# EAGLE design Arduino_Nano_Clock_Divider_pcb2 (EAGLE 9.1.1)
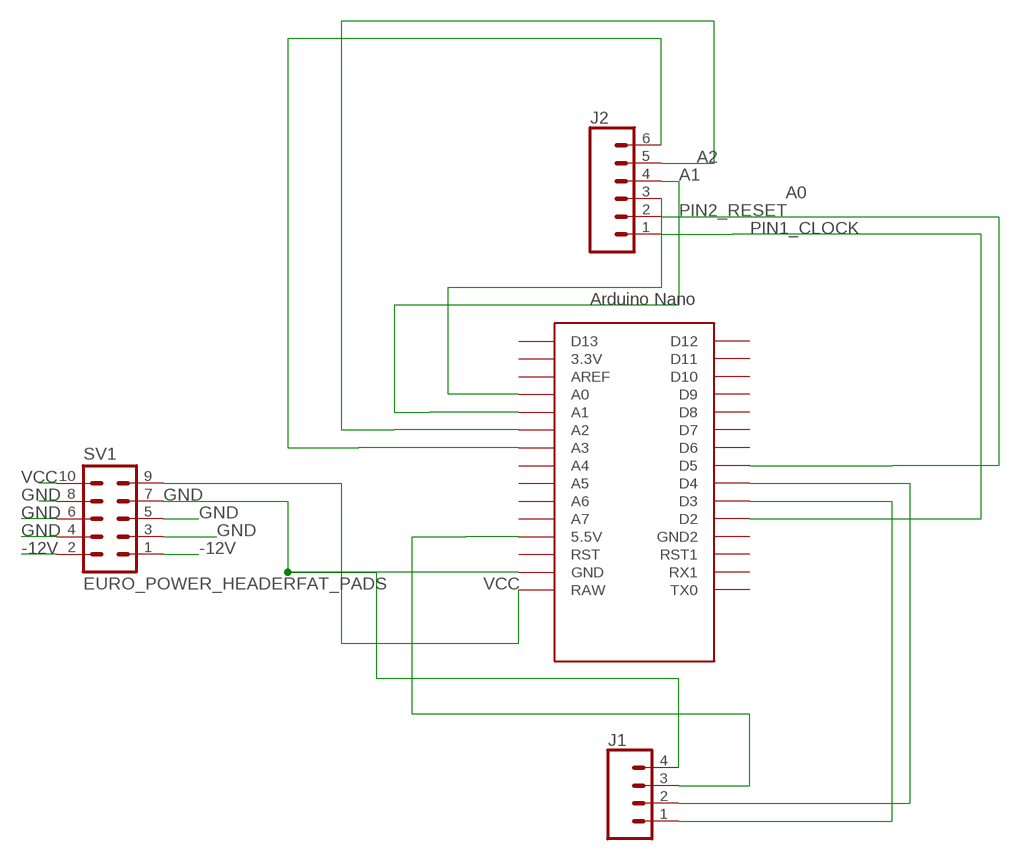
[diagram p0: schematic, sheet 1]

## Parts
J1  CONN_04LONGPADS  [1X04_LONGPADS]
J2  CONN_06LONGPADS  [1X06_LONGPADS]
SV1  EURO_POWER_HEADERFAT_PADS  [EURO_PWR_HEADER_FAT]
U$1  NANO  [NANO]

## Nets
-12V: SV1.1 SV1.2
A0: J2.3 U$1.A0
A1: J2.4 U$1.A1
A2: J2.5 U$1.A2
A3: J2.6 U$1.A3
D3: J1.1 U$1.D3
GND: J1.4 SV1.3 SV1.4 SV1.5 SV1.6 SV1.7 SV1.8 U$1.GND
N$2: J1.3 U$1.5V(5.5V)
N$9: J1.2 U$1.D4
PIN1_CLOCK: J2.1 U$1.D2
PIN2_RESET: J2.2 U$1.D5
VCC: SV1.9 SV1.10 U$1.RAW
Unconnected: U$1.3.3V U$1.A4 U$1.A5 U$1.A6 U$1.A7 U$1.AREF U$1.D6 U$1.D7 U$1.D8 U$1.D9 U$1.D10 U$1.D11 U$1.D12 U$1.D13 U$1.GND1(GND2) U$1.ICSP1 U$1.ICSP2 U$1.ICSP3 U$1.ICSP4 U$1.ICSP5 U$1.ICSP6 U$1.RST U$1.RST1 U$1.RX1 U$1.TX0

## Library data of the parts
J1 = SparkFun-Connectors:CONN_04: Multi connection point. Often used as Generic Header-pin footprint for 0.1 inch spaced/style header connections On any of the 0.1 inch spaced packages, you can populate with these: Break Away Headers - Straight <https://www.sparkfun.com/products/116> (PRT-00116) Break Away Male Headers - Right Angle <https://www.sparkfun.com/products/553> (PRT-00553) Female Headers <https://www.sparkfun.com/products/115> (PRT-00115) Break Away Headers - Machine Pin <https://www.sparkfun.com/products/117> (PRT-00117) Break Away Female Headers - Swiss Machine Pin <https://www.sparkfun.com/products/743> (PRT-00743) For SCREWTERMINALS and SPRING TERMINALS visit here: Screw Terimnals on SparkFun.com <https://www.sparkfun.com/search/results?term=Screw+Terminals> (5mm/3.5mm/2.54mm spacing) This device is also useful as a general connection point to wire up your design to another part of your project. Our various solder wires solder well into these plated through hole pads. Hook-Up Wire - Assortment (Stranded, 22 AWG) <https://www.sparkfun.com/products/11375> (PRT-11375) Hook-Up Wire - Assortment (Solid Core, 22 AWG) <https://www.sparkfun.com/products/11367> (PRT-11367) View the entire wire category on our website here <https://www.sparkfun.com/categories/141> Special notes: Molex polarized connector foot print use with SKU : PRT-08231 with associated crimp pins and housings. 1MM SMD Version SKU: PRT-10208; PROD_ID: CONN-09696
J2 = SparkFun-Connectors:CONN_06: Multi connection point. Often used as Generic Header-pin footprint for 0.1 inch spaced/style header connections On any of the 0.1 inch spaced packages, you can populate with these: Break Away Headers - Straight <https://www.sparkfun.com/products/116> (PRT-00116) Break Away Male Headers - Right Angle <https://www.sparkfun.com/products/553> (PRT-00553) Female Headers <https://www.sparkfun.com/products/115> (PRT-00115) Break Away Headers - Machine Pin <https://www.sparkfun.com/products/117> (PRT-00117) Break Away Female Headers - Swiss Machine Pin <https://www.sparkfun.com/products/743> (PRT-00743) Arduino Stackable Header - 6 Pin <https://www.sparkfun.com/products/9280> (PRT-09280) For SCREWTERMINALS and SPRING TERMINALS visit here: Screw Terimnals on SparkFun.com <https://www.sparkfun.com/search/results?term=Screw+Terminals> (5mm/3.5mm/2.54mm spacing) This device is also useful as a general connection point to wire up your design to another part of your project. Our various solder wires solder well into these plated through hole pads. Hook-Up Wire - Assortment (Stranded, 22 AWG) <https://www.sparkfun.com/products/11375> (PRT-11375) Hook-Up Wire - Assortment (Solid Core, 22 AWG) <https://www.sparkfun.com/products/11367> (PRT-11367) View the entire wire category on our website here <https://www.sparkfun.com/categories/141>
SV1 = MusicThingModular:EURO_POWER_HEADER: Power Header 10 pin power header for Eurorack Power Supplies Variants with fatter pads for easier soldering, and the LOCK variant which has 5mil offset pins to hold the component in place before soldering
U$1 = Arduino-clone:NANO: Arduino Nano

## Board
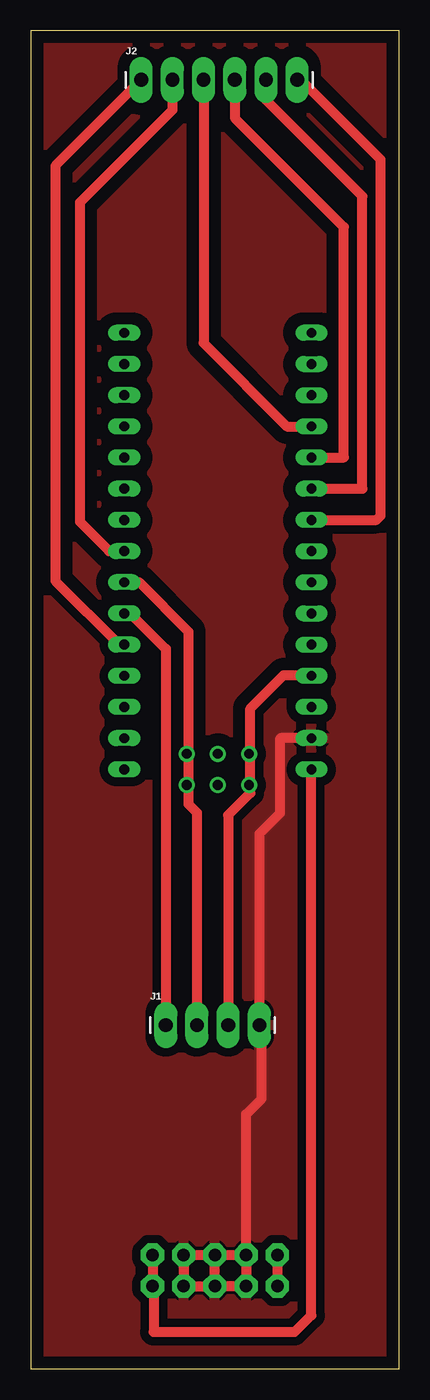
[diagram p1: board, top side]
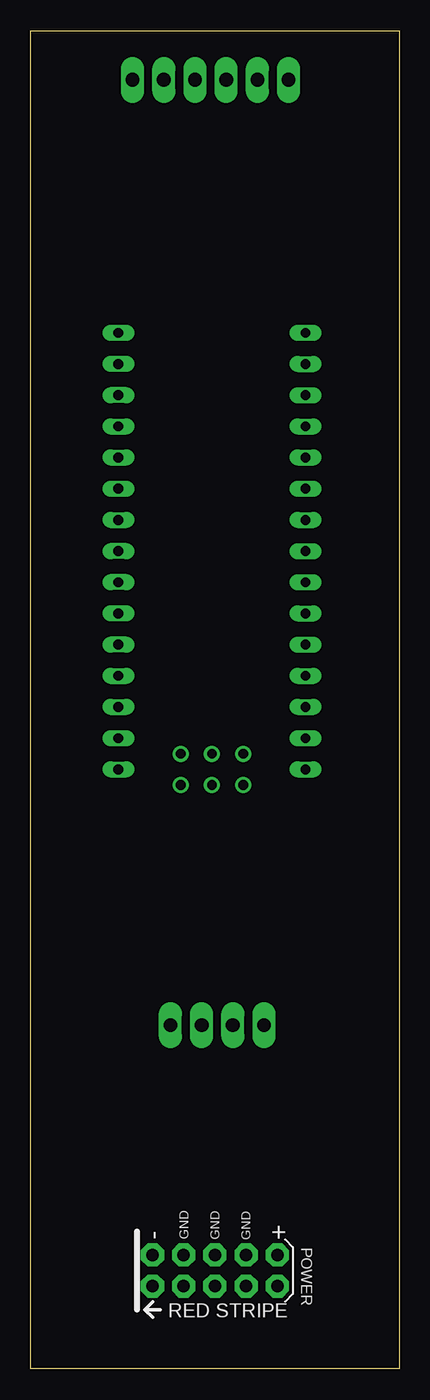
[diagram p2: board, bottom side, seen from below]

Size 30 x 109 mm. Coordinates in mm from the lower left corner, seen from the top.
Outline: 0,0 30,0 30,109 0,109 0,0
Copper layers (1*16): Top 0.035mm / dielectric 1.5mm / Bottom 0.035mm
Design rules "default": minimum track width 6mil, minimum drill 0.35mm, track to track 6mil, track to pad 6mil, pad to pad 6mil, via to via 6mil, smd to smd 6mil, copper to edge 40mil, drill to drill 6mil, minimum pad ring 10mil, minimum via ring 8mil, stop-mask expansion 4mil, vias tented up to drill 0mil, thermal gap 10mil

### Footprints (pad centres in the part's own frame; a part is rotated, then mirrored left to right if it is on the bottom)
1X04_LONGPADS = drill 1.118 pad 1.88 long: 1 0,0; 2 2.54,0; 3 5.08,0; 4 7.62,0
1X06_LONGPADS = drill 1.118 pad 1.88 long: 1 0,0; 2 2.54,0; 3 5.08,0; 4 7.62,0; 5 10.16,0; 6 12.7,0
EURO_PWR_HEADER_FAT = drill 1.016 pad 1.88 octagon: 1 -5.08,-1.27; 2 -5.08,1.27; 3 -2.54,-1.27; 4 -2.54,1.27; 5 0,-1.27; 6 0,1.27; 7 2.54,-1.27; 8 2.54,1.27; 9 5.08,-1.27; 10 5.08,1.27
NANO = drill 0.8 long: 3.3V -10.16,24.13; 5V -10.16,-1.27; A0 -10.16,19.05; A1 -10.16,16.51; A2 -10.16,13.97; A3 -10.16,11.43; A4 -10.16,8.89; A5 -10.16,6.35; A6 -10.16,3.81; A7 -10.16,1.27; AREF -10.16,21.59; D2 5.08,1.27; D3 5.08,3.81; D4 5.08,6.35; D5 5.08,8.89; D6 5.08,11.43; D7 5.08,13.97; D8 5.08,16.51; D9 5.08,19.05; D10 5.08,21.59; D11 5.08,24.13; D12 5.08,26.67; D13 -10.16,26.67; GND -10.16,-6.35; GND1 5.08,-1.27; RAW -10.16,-8.89; RST -10.16,-3.81; RST1 5.08,-3.81; RX1 5.08,-6.35; TX0 5.08,-8.89 | drill 0.8: ICSP1 -5.08,-10.16; ICSP2 -5.08,-7.62; ICSP3 -2.54,-10.16; ICSP4 -2.54,-7.62; ICSP5 0,-10.16; ICSP6 0,-7.62

### Placement (x,y rotation side)
J1  11,28 0 top
J2  9,105 0 top
SV1  15,8 0 bottom
U$1  12.7,57.72 0 bottom

### Tracks (layer width: path | path; a pad name or v marks a point on that pad's centre or on a via)
-12V
  Top 0.813: SV1.2 SV1.1
A0
  Top 0.813: J2.3 14.08,83.55 20.86,76.77 U$1.A0
A1
  Top 0.813: J2.4 16.62,101.88 25.5,93 25.5,74.23 U$1.A1
A2
  Top 0.813: U$1.A2 27,71.69 27,95.5 19.16,103.34 J2.5
A3
  Top 0.813: J2.6 22,105 27.5,99.5 28,99 28.5,98.5 28.5,69.5 28.15,69.15 U$1.A3
D3
  Top 0.813: J1.1 11,58.65 8.12,61.53 U$1.D3
GND
  Top 0.813: SV1.6 SV1.8 SV1.7 SV1.5 | SV1.5 SV1.6 | SV1.6 SV1.4 | SV1.4 SV1.3 SV1.5 | U$1.GND 20.36,51.37 20.29,51.3 20.29,45.26 18.62,43.59 J1.4 18.8,27.82 18.8,22 17.54,20.74 SV1.4
  pour Top (isolate 0.7): 0.1,0 0.1,109 30,109 30,0
N$1
  pour Top (isolate 1): 0,109 30,109 30,0 1,0 0,-1
N$2
  Top 0.813: J1.3 16.08,45.1 17.88,46.9 17.88,53.78 20.6,56.5 22.81,56.5 U$1.5V
N$9
  Top 0.813: U$1.D4 8.82,64.07 12.84,60.05 12.84,46 13.54,45.3 J1.2
PIN1_CLOCK
  Top 0.813: J2.1 2,98 2,64.19 7.2,58.99 U$1.D2
PIN2_RESET
  Top 0.813: J2.2 11.54,102.54 4,95 4,69 6.39,66.61 U$1.D5
VCC
  Top 0.813: SV1.10 SV1.9 10,6.65 10,3 21.5,3 22.86,4.36 U$1.RAW